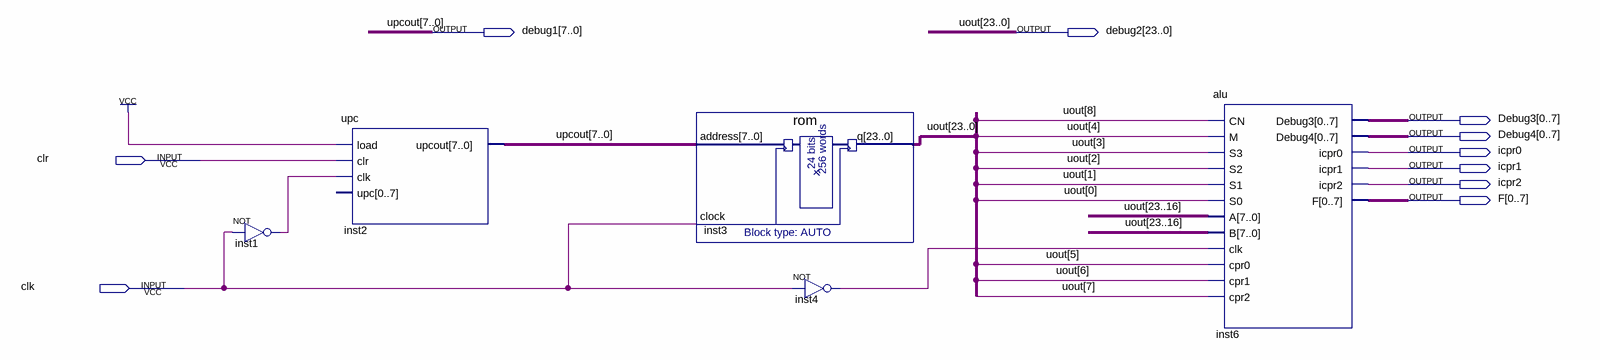
[diagram p0: schematic sheet]
// Quartus schematic ex1.bdf as structural Verilog: 5 symbols, 10 pins
module ex1 (
  input  clr,
  input  clk,
  output [7:0] debug1,
  output [23:0] debug2,
  output [0:7] Debug3,
  output [0:7] Debug4,
  output icpr0,
  output icpr1,
  output icpr2,
  output [0:7] F
);

  wire inst1_out, inst4_out;

  not inst1 (inst1_out, clk);
  upc inst2 (.load(1'b1), .clr(clr), .clk(inst1_out), .upcout(debug1));  // open: upc
  rom inst3 (.address(debug1), .clock(clk), .q(debug2));
  not inst4 (inst4_out, clk);
  alu inst6 (
    .CN(debug2[8]), .M(debug2[4]), .S3(debug2[3]), .S2(debug2[2]), .S1(debug2[1]), .S0(debug2[0]),
    .A(debug2[23:16]), .B(debug2[23:16]), .clk(inst4_out), .cpr0(debug2[5]), .cpr1(debug2[6]),
    .cpr2(debug2[7]), .Debug3(Debug3), .Debug4(Debug4), .icpr0(icpr0), .icpr1(icpr1), .icpr2(icpr2), .F(F));

  // Other names for the same wires on the sheet: uout[23:0] = debug2; upcout[7:0] = debug1
endmodule
